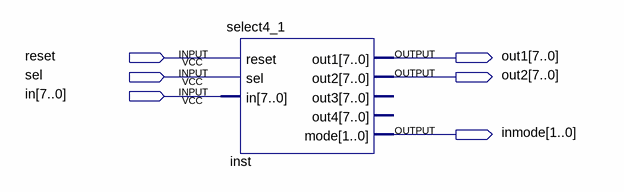
[diagram p0: schematic sheet]
// Quartus schematic select1.bdf as structural Verilog: 1 symbols, 6 pins
module select1 (
  input  reset,
  input  sel,
  input  [7:0] in,
  output [7:0] out1,
  output [7:0] out2,
  output [1:0] inmode
);

  select4_1 inst (.reset(reset), .sel(sel), .in(in), .out1(out1), .out2(out2), .mode(inmode));  // open: out3, out4
endmodule
